# EAGLE design StandPanel (EAGLE 9.1.3)
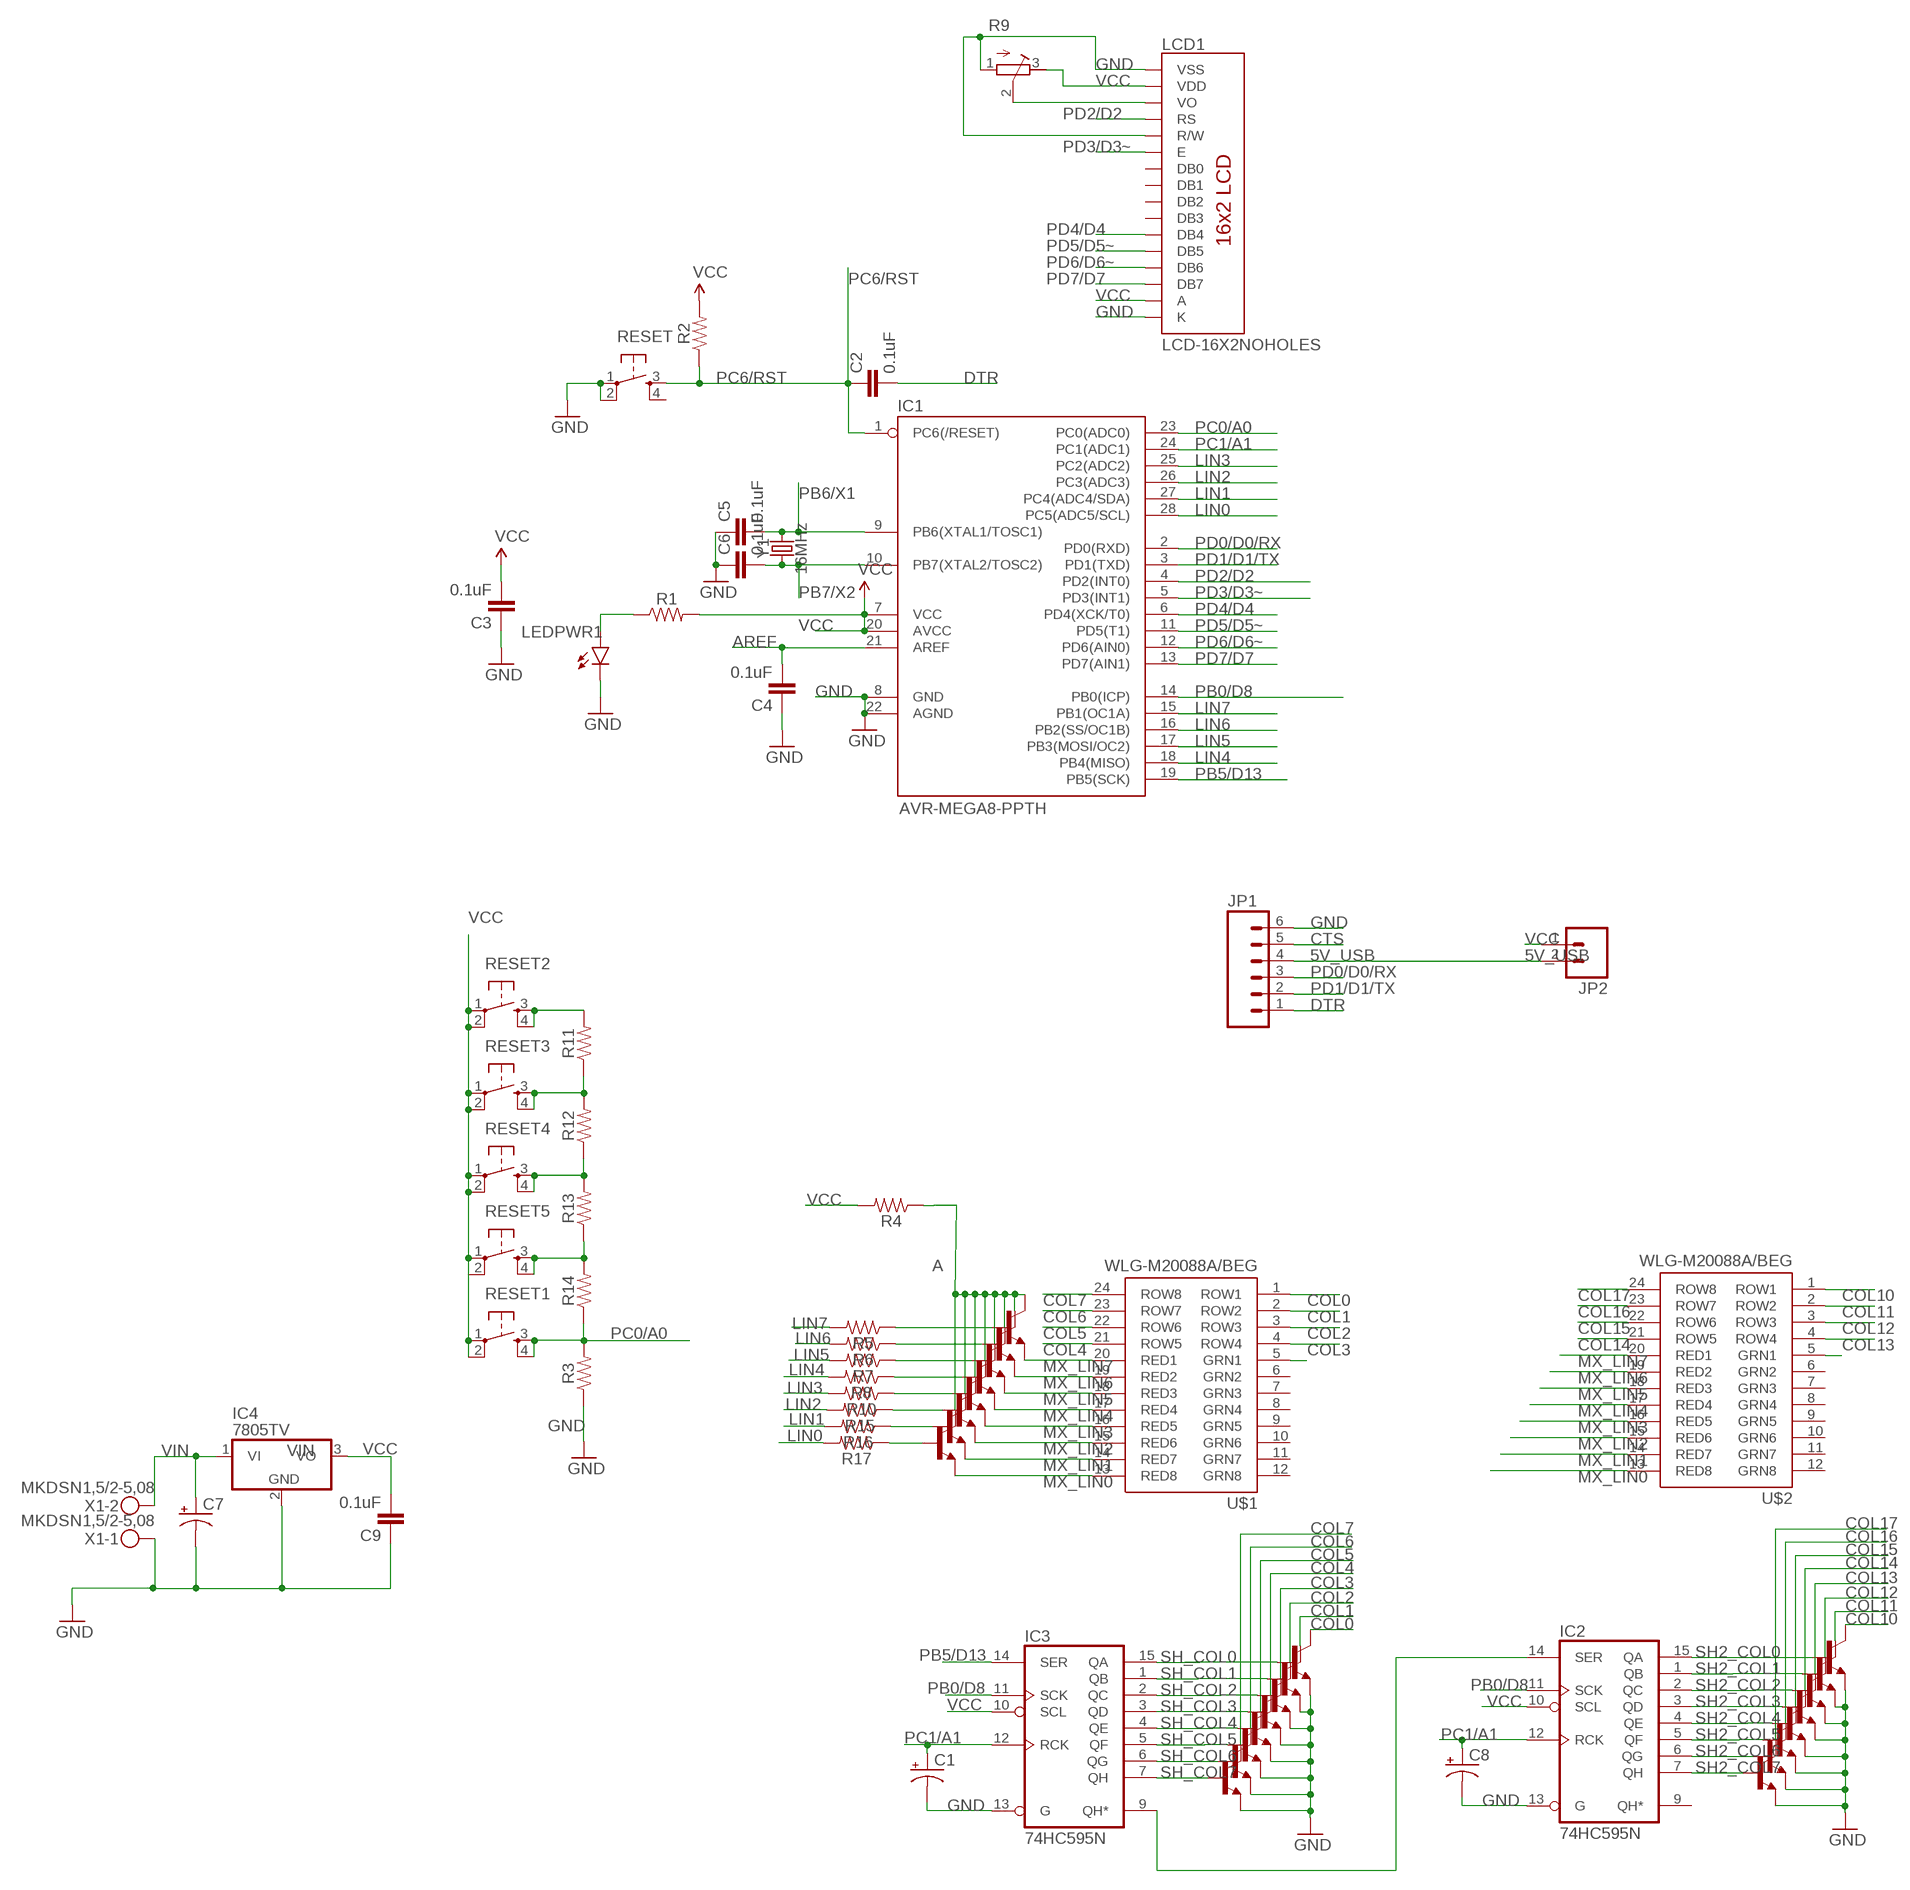
[diagram p0: schematic, sheet 1]

## Parts
C1  CAP_POLPTH2  [CPOL-RADIAL-10UF-25V]
C2  0.1uF  0.1UF-KIT-EZ-50V-20%  [CAP-PTH-SMALL-KIT]
C3  0.1uF  0.1UF-KIT-EZ-50V-20%  [CAP-PTH-SMALL-KIT]
C4  0.1uF  0.1UF-KIT-EZ-50V-20%  [CAP-PTH-SMALL-KIT]
C5  0.1uF  0.1UF-KIT-EZ-50V-20%  [CAP-PTH-SMALL-KIT]
C6  0.1uF  0.1UF-KIT-EZ-50V-20%  [CAP-PTH-SMALL-KIT]
C7  CAP_POLPTH1  [CPOL-RADIAL-100UF-25V]
C8  CAP_POLPTH2  [CPOL-RADIAL-10UF-25V]
C9  0.1uF  0.1UF-KIT-EZ-50V-20%  [CAP-PTH-SMALL-KIT]
IC1  AVR-MEGA8-PPTH  [DIL28-3]
IC2  74HC595N  [DIL16]
IC3  74HC595N  [DIL16]
IC4  7805TV  [TO220V]
JP1  M06SIP  [1X06]
JP2  M02PTH  [1X02]
LCD1  LCD-16X2NOHOLES  [LCD-16X2_NOHOLESNOSILK]
LEDPWR1  LED5MM-KIT  [LED_5MM-KIT]
R1  RESISTORAXIAL-0.3-KIT  [AXIAL-0.3-KIT]
R2  RESISTORAXIAL-0.3-KIT  [AXIAL-0.3-KIT]
R3  RESISTORAXIAL-0.3-KIT  [AXIAL-0.3-KIT]
R4  RESISTORAXIAL-0.3-KIT  [AXIAL-0.3-KIT]
R5  RESISTORAXIAL-0.3-KIT  [AXIAL-0.3-KIT]
R6  RESISTORAXIAL-0.3-KIT  [AXIAL-0.3-KIT]
R7  RESISTORAXIAL-0.3-KIT  [AXIAL-0.3-KIT]
R8  RESISTORAXIAL-0.3-KIT  [AXIAL-0.3-KIT]
R9  R-TRIMM3296W  [RTRIM3296W]
R10  RESISTORAXIAL-0.3-KIT  [AXIAL-0.3-KIT]
R11  RESISTORAXIAL-0.3-KIT  [AXIAL-0.3-KIT]
R12  RESISTORAXIAL-0.3-KIT  [AXIAL-0.3-KIT]
R13  RESISTORAXIAL-0.3-KIT  [AXIAL-0.3-KIT]
R14  RESISTORAXIAL-0.3-KIT  [AXIAL-0.3-KIT]
R15  RESISTORAXIAL-0.3-KIT  [AXIAL-0.3-KIT]
R16  RESISTORAXIAL-0.3-KIT  [AXIAL-0.3-KIT]
R17  RESISTORAXIAL-0.3-KIT  [AXIAL-0.3-KIT]
RESET  TAC_SWITCHPTH  [TACTILE-PTH]
RESET1  TAC_SWITCHPTH  [TACTILE-PTH]
RESET2  TAC_SWITCHPTH  [TACTILE-PTH]
RESET3  TAC_SWITCHPTH  [TACTILE-PTH]
RESET4  TAC_SWITCHPTH  [TACTILE-PTH]
RESET5  TAC_SWITCHPTH  [TACTILE-PTH]
T1  BC337  [TO92]
T3  BC337  [TO92]
T4  BC337  [TO92]
T5  BC337  [TO92]
T6  BC337  [TO92]
T7  BC337  [TO92]
T8  BC337  [TO92]
T9  BC337  [TO92]
T10  BC337  [TO92]
T11  BC337  [TO92]
T12  BC337  [TO92]
T13  BC337  [TO92]
T14  BC337  [TO92]
T15  BC337  [TO92]
T16  BC337  [TO92]
T17  BC337  [TO92]
T25  BC337  [TO92]
T26  BC337  [TO92]
T27  BC337  [TO92]
T28  BC337  [TO92]
T29  BC337  [TO92]
T30  BC337  [TO92]
T31  BC337  [TO92]
T32  BC337  [TO92]
U$1  WLG-M20088A/BEG  [WLG-M2088A/8EG]
U$2  WLG-M20088A/BEG  [WLG-M2088A/8EG]
X1  MKDSN1,5/2-5,08  [MKDSN1,5/2-5,08]
Y1  16MHz  CRYSTAL-16MHZPTH-HC49US  [HC49US]

## Nets
5V_USB: JP1.4 JP2.2
A: R4.P$1 T1.3(C) T3.3(C) T4.3(C) T5.3(C) T6.3(C) T7.3(C) T8.3(C) T9.3(C)
AREF: C4.2 IC1.21(AREF)
COL0: T10.3(C) U$1.1(ROW1)
COL1: T11.3(C) U$1.2(ROW2)
COL2: T12.3(C) U$1.3(ROW3)
COL3: T13.3(C) U$1.4(ROW4)
COL4: T14.3(C) U$1.21(ROW5)
COL5: T15.3(C) U$1.22(ROW6)
COL6: T16.3(C) U$1.23(ROW7)
COL7: T17.3(C) U$1.24(ROW8)
COL10: T25.3(C) U$2.1(ROW1)
COL11: T26.3(C) U$2.2(ROW2)
COL12: T27.3(C) U$2.3(ROW3)
COL13: T28.3(C) U$2.4(ROW4)
COL14: T29.3(C) U$2.21(ROW5)
COL15: T30.3(C) U$2.22(ROW6)
COL16: T31.3(C) U$2.23(ROW7)
COL17: T32.3(C) U$2.24(ROW8)
CTS: JP1.5
DTR: C2.2 JP1.1
GND: C1.2(-) C3.1 C4.1 C5.1 C6.1 C7.2(-) C8.2(-) C9.1 IC1.8(GND) IC1.22(AGND) IC2.13(G) IC3.13(G) IC4.2(GND) JP1.6 LCD1.1(VSS) LCD1.5(R/W) LCD1.16(K) LEDPWR1.K(C) R3.P$1 R9.1(A) RESET.1 RESET.2 T10.1(E) T11.1(E) T12.1(E) T13.1(E) T14.1(E) T15.1(E) T16.1(E) T17.1(E) T25.1(E) T26.1(E) T27.1(E) T28.1(E) T29.1(E) T30.1(E) T31.1(E) T32.1(E) X1.1
LIN0: IC1.28(PC5(ADC5/SCL)) R17.P$2
LIN1: IC1.27(PC4(ADC4/SDA)) R16.P$2
LIN2: IC1.26(PC3(ADC3)) R15.P$2
LIN3: IC1.25(PC2(ADC2)) R10.P$2
LIN4: IC1.18(PB4(MISO)) R8.P$2
LIN5: IC1.17(PB3(MOSI/OC2)) R7.P$2
LIN6: IC1.16(PB2(SS/OC1B)) R6.P$2
LIN7: IC1.15(PB1(OC1A)) R5.P$2
LIN8: T10.2(B)
MX_LIN0: T9.1(E) U$1.13(RED8) U$2.13(RED8)
MX_LIN1: T8.1(E) U$1.14(RED7) U$2.14(RED7)
MX_LIN2: T7.1(E) U$1.15(RED6) U$2.15(RED6)
MX_LIN3: T6.1(E) U$1.16(RED5) U$2.16(RED5)
MX_LIN4: T5.1(E) U$1.17(RED4) U$2.17(RED4)
MX_LIN5: T4.1(E) U$1.18(RED3) U$2.18(RED3)
MX_LIN6: T3.1(E) U$1.19(RED2) U$2.19(RED2)
MX_LIN7: T1.1(E) U$1.20(RED1) U$2.20(RED1)
N$1: LEDPWR1.A R1.P$1
N$2: R17.P$1 T9.2(B)
N$3: R16.P$1 T8.2(B)
N$4: U$1.5(GRN1)
N$5: LCD1.3(VO) R9.2(S)
N$6: R15.P$1 T7.2(B)
N$7: IC2.14(SER) IC3.9(QH*)
N$8: R10.P$1 T6.2(B)
N$9: R8.P$1 T5.2(B)
N$10: R7.P$1 T4.2(B)
N$11: R6.P$1 T3.2(B)
N$12: R5.P$1 T1.2(B)
N$18: U$2.5(GRN1)
N$30: R11.P$2 RESET2.3 RESET2.4
N$31: R11.P$1 R12.P$2 RESET3.3 RESET3.4
N$32: R12.P$1 R13.P$2 RESET4.3 RESET4.4
PB0/D8: IC1.14(PB0(ICP)) IC2.11(SCK) IC3.11(SCK)
PB5/D13: IC1.19(PB5(SCK)) IC3.14(SER)
PB6/X1: C5.2 IC1.9(PB6(XTAL1/TOSC1)) Y1.2
PB7/X2: C6.2 IC1.10(PB7(XTAL2/TOSC2)) Y1.1
PC0/A0: IC1.23(PC0(ADC0)) R3.P$2 R13.P$1 R14.P$1 R14.P$2 RESET1.3 RESET1.4 RESET5.3 RESET5.4
PC1/A1: C1.1(+) C8.1(+) IC1.24(PC1(ADC1)) IC2.12(RCK) IC3.12(RCK)
PC6/RST: C2.1 IC1.1(PC6(/RESET)) R2.P$1 RESET.3
PD0/D0/RX: IC1.2(PD0(RXD)) JP1.3
PD1/D1/TX: IC1.3(PD1(TXD)) JP1.2
PD2/D2: IC1.4(PD2(INT0)) LCD1.4(RS)
PD3/D3~: IC1.5(PD3(INT1)) LCD1.6(E)
PD4/D4: IC1.6(PD4(XCK/T0)) LCD1.11(DB4)
PD5/D5~: IC1.11(PD5(T1)) LCD1.12(DB5)
PD6/D6~: IC1.12(PD6(AIN0)) LCD1.13(DB6)
PD7/D7: IC1.13(PD7(AIN1)) LCD1.14(DB7)
SH2_COL0: IC2.15(QA) T25.2(B)
SH2_COL1: IC2.1(QB) T26.2(B)
SH2_COL2: IC2.2(QC) T27.2(B)
SH2_COL3: IC2.3(QD) T28.2(B)
SH2_COL4: IC2.4(QE) T29.2(B)
SH2_COL5: IC2.5(QF) T30.2(B)
SH2_COL6: IC2.6(QG) T31.2(B)
SH2_COL7: IC2.7(QH) T32.2(B)
SH_COL0: IC3.15(QA)
SH_COL1: IC3.1(QB) T11.2(B)
SH_COL2: IC3.2(QC) T12.2(B)
SH_COL3: IC3.3(QD) T13.2(B)
SH_COL4: IC3.4(QE) T14.2(B)
SH_COL5: IC3.5(QF) T15.2(B)
SH_COL6: IC3.6(QG) T16.2(B)
SH_COL7: IC3.7(QH) T17.2(B)
VCC: C3.2 C9.2 IC1.7(VCC) IC1.20(AVCC) IC2.10(SCL) IC3.10(SCL) IC4.3(VO) JP2.1 LCD1.2(VDD) LCD1.15(A) R1.P$2 R2.P$2 R4.P$2 R9.3(E) RESET2.1 RESET2.2 RESET3.1 RESET3.2 RESET4.1 RESET4.2 RESET5.1 RESET5.2
VCC1: RESET1.1 RESET1.2
VIN: C7.1(+) IC4.1(VI) X1.2
Unconnected: IC2.9(QH*) LCD1.7(DB0) LCD1.8(DB1) LCD1.9(DB2) LCD1.10(DB3) RESET.4 U$1.6(GRN2) U$1.7(GRN3) U$1.8(GRN4) U$1.9(GRN5) U$1.10(GRN6) U$1.11(GRN7) U$1.12(GRN8) U$2.6(GRN2) U$2.7(GRN3) U$2.8(GRN4) U$2.9(GRN5) U$2.10(GRN6) U$2.11(GRN7) U$2.12(GRN8)

## Power pins joined to a net without a drawn wire
GND: IC2.8(GND) IC3.8(GND)
VCC: IC2.16(VCC) IC3.16(VCC)

## Library data of the parts
C1 C7 C8 = SparkFun-Capacitors:CAP_POL: Capacitor Polarized These are standard SMD and PTH capacitors. Normally 10uF, 47uF, and 100uF in electrolytic and tantalum varieties. Always verify the external diameter of the through hole cap, it varies with capacity, voltage, and manufacturer. The EIA devices should be standard.
C2-C6 C9 = SparkFun-Capacitors:0.1UF: 0.1µF ceramic capacitors A capacitor is a passive two-terminal electrical component used to store electrical energy temporarily in an electric field.; PROD_ID: CAP-08370
IC1 = SparkFun-DigitalIC:AVR-MEGA8-P: MICROCONTROLLER 8 Kbytes FLASH 1 kbytes SRAM 512 bytes EEPROM USART 4-channel 10 bit ADC 2-channel 8 bit ADC
IC2 IC3 = 74xx-eu:74*595: 8-bit SHIFT REGISTER, output latch
IC4 = linear:78*: Positive VOLTAGE REGULATOR Source: http://cache.national.com/ds/LM/LM78L05.pdf http://www.fairchildsemi.com/ds/LM/LM7805.pdf
JP1 = SparkFun:M06: Header 6 Standard 6-pin 0.1" header. Use with straight break away headers (SKU : PRT-00116), right angle break away headers (PRT-00553), swiss pins (PRT-00743), machine pins (PRT-00117), and female headers (PRT-00115). Molex polarized connector foot print use with SKU : PRT-08094 with associated crimp pins and housings. NOTES ON THE VARIANTS LOCK and LOCK_LONGPADS... This footprint was designed to help hold the alignment of a through-hole component (i.e. 6-pin header) while soldering it into place. You may notice that each hole has been shifted either up or down by 0.005 of an inch from it's more standard position (which is a perfectly straight line). This slight alteration caused the pins (the squares in the middle) to touch the edges of the holes. Because they are alternating, it causes a "brace" to hold the component in place. 0.005 has proven to be the perfect amount of "off-center" position when using our standard breakaway headers. Although looks a little odd when you look at the bare footprint, once you have a header in there, the alteration is very hard to notice. Also, if you push a header all the way into place, it is covered up entirely on the bottom side. This idea of altering the position of holes to aid alignment will be further integrated into the Sparkfun Library for other footprints. It can help hold any component with 3 or more connection pins.
JP2 = SparkFun:M02: Header 2 Standard 2-pin 0.1" header. Use with straight break away headers (SKU : PRT-00116), right angle break away headers (PRT-00553), swiss pins (PRT-00743), machine pins (PRT-00117), and female headers (PRT-00115). Molex polarized connector foot print use with SKU : PRT-08233 with associated crimp pins and housings.
LCD1 = SparkFun-Displays:LCD-16X2: Standard text-only 16x2 parallel input LCD Basic 16 character by 2 line display. Typically utilizes the extremely common HD44780 parallel interface chipset SparkFun Products: Basic 16x2 Green <https://www.sparkfun.com/products/255> Basic 8x2 Green <https://www.sparkfun.com/products/11122>; SF_ID: LCD-00255
LEDPWR1 = SparkFun-LED:LED: LED (Generic) Standard schematic elements and footprints for 5mm, 3mm, 1206, and 0603 sized LEDs. Generic LEDs with no color specified.
R1-R8 R10-R17 = SparkFun-Resistors:RESISTOR: Generic Resistor Package
R9 = resistor:R-TRIMM: Trimm resistor
RESET RESET1-RESET5 = SparkFun-Electromechanical:TAC_SWITCH: Momentary Switch Button commonly used for reset or general input. Spark Fun Electronics SKU : COM-00097
T1 T3-T17 T25-T32 = transistor:BC337: NPN TRANSISTOR
U$1 U$2 = led-matrix-v3:WLG-M20088A/BEG: LED Matrix - Dual Color (Red + Green) - Medium sku: COM-00682 0.33 x 2 x 2"
X1 = con-phoenix-508:MKDSN1,5/2-5,08: MKDSN 1,5/ 2-5,08 Printklemme Nennstrom: 13,5 A Nennspannung: 250 V Rastermaß: 5,08 mm Polzahl: 2 Anschlussart: Schraubanschluss Montage: Löten Anschlussrichtung Leiter/Platine: 0 ° Artikelnummer: 1729128 Source: http://eshop.phoenixcontact.com .. 1729128.pdf
Y1 = SparkFun-Clocks:CRYSTAL-16MHZ: 16MHz Crystal Digikey Example <http://www.digikey.com/product-search/en?keywords=535-9122-1-ND> Frequency: 16MHz Frequency Stability: ±50ppm Frequency Tolerance: ±20ppm Load Capacitance: 18pF SparkFun Products: Pro Micro -5V/16MHz <https://www.sparkfun.com/products/12640> SparkFun Serial Enabled LCD Kit <https://www.sparkfun.com/products/10097>; PROD_ID: XTAL-08181; SF_ID: COM-00536

## Net classes
0 default: width 0.8 mm, drill 0.9 mm, clearance 0.406 mm

## Board
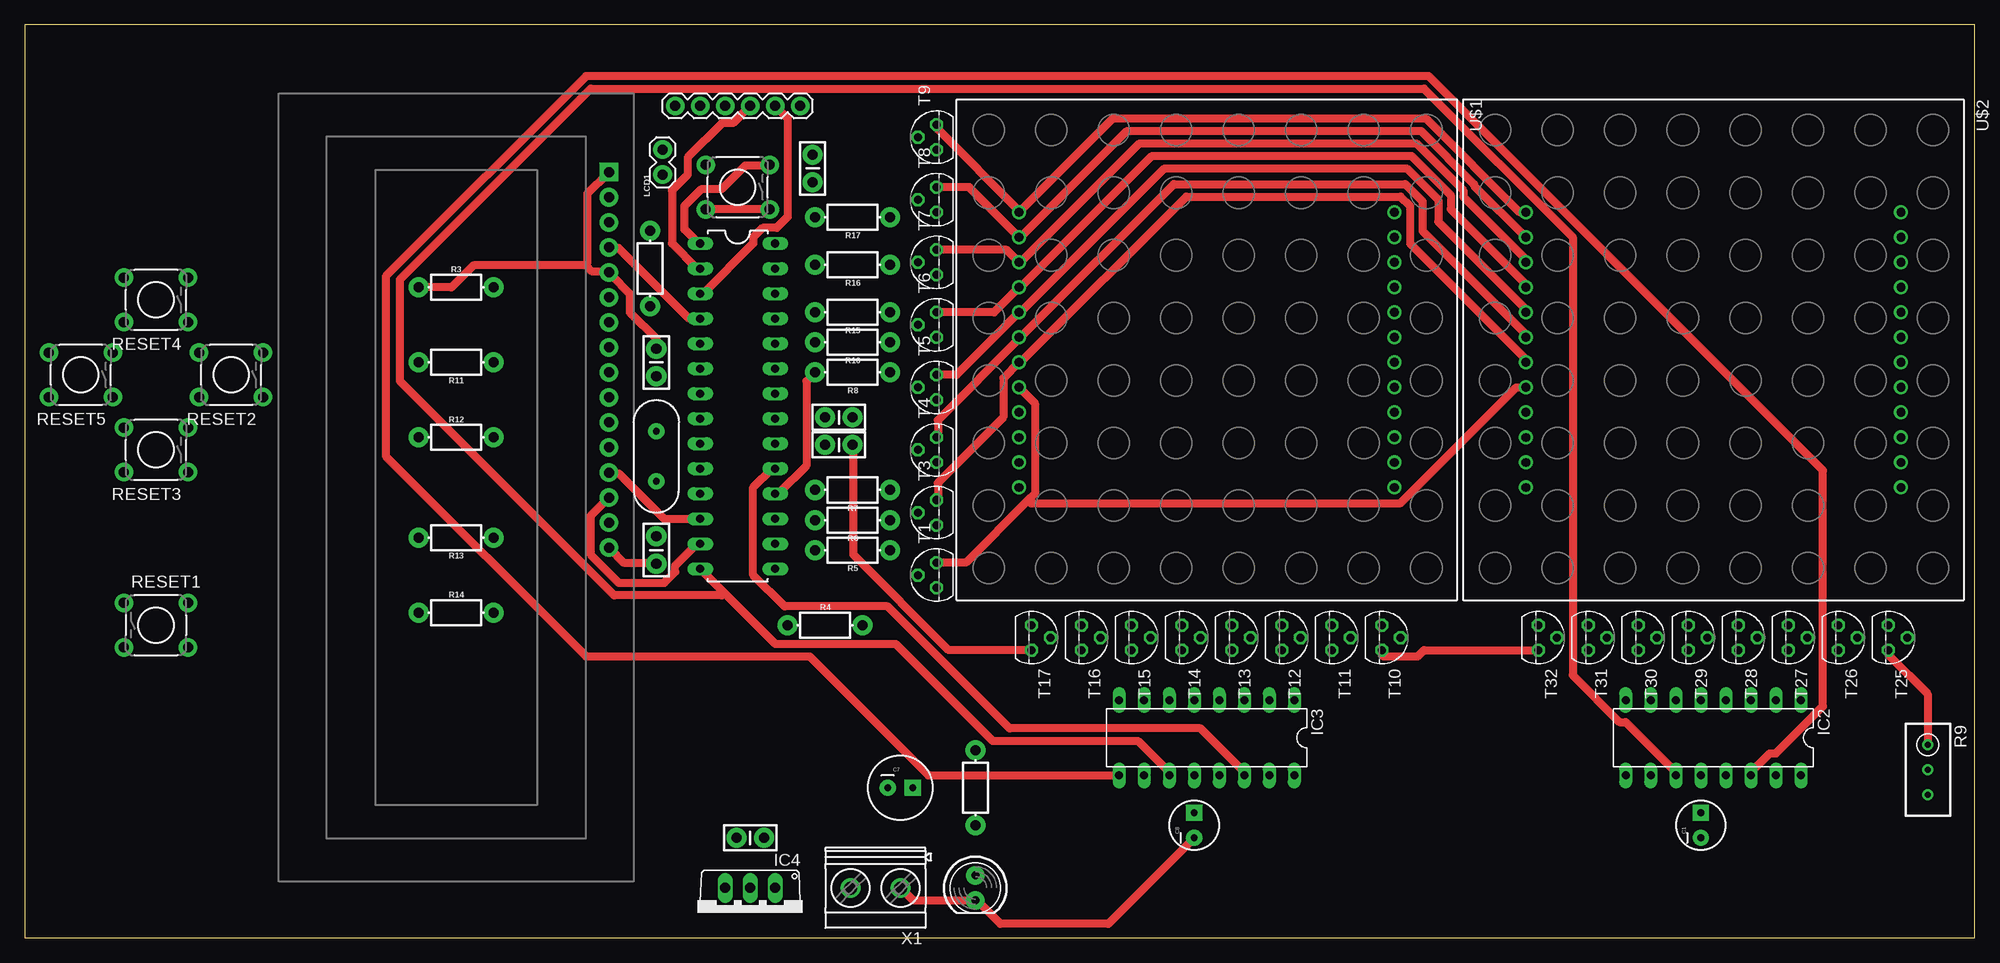
[diagram p1: board, top side]
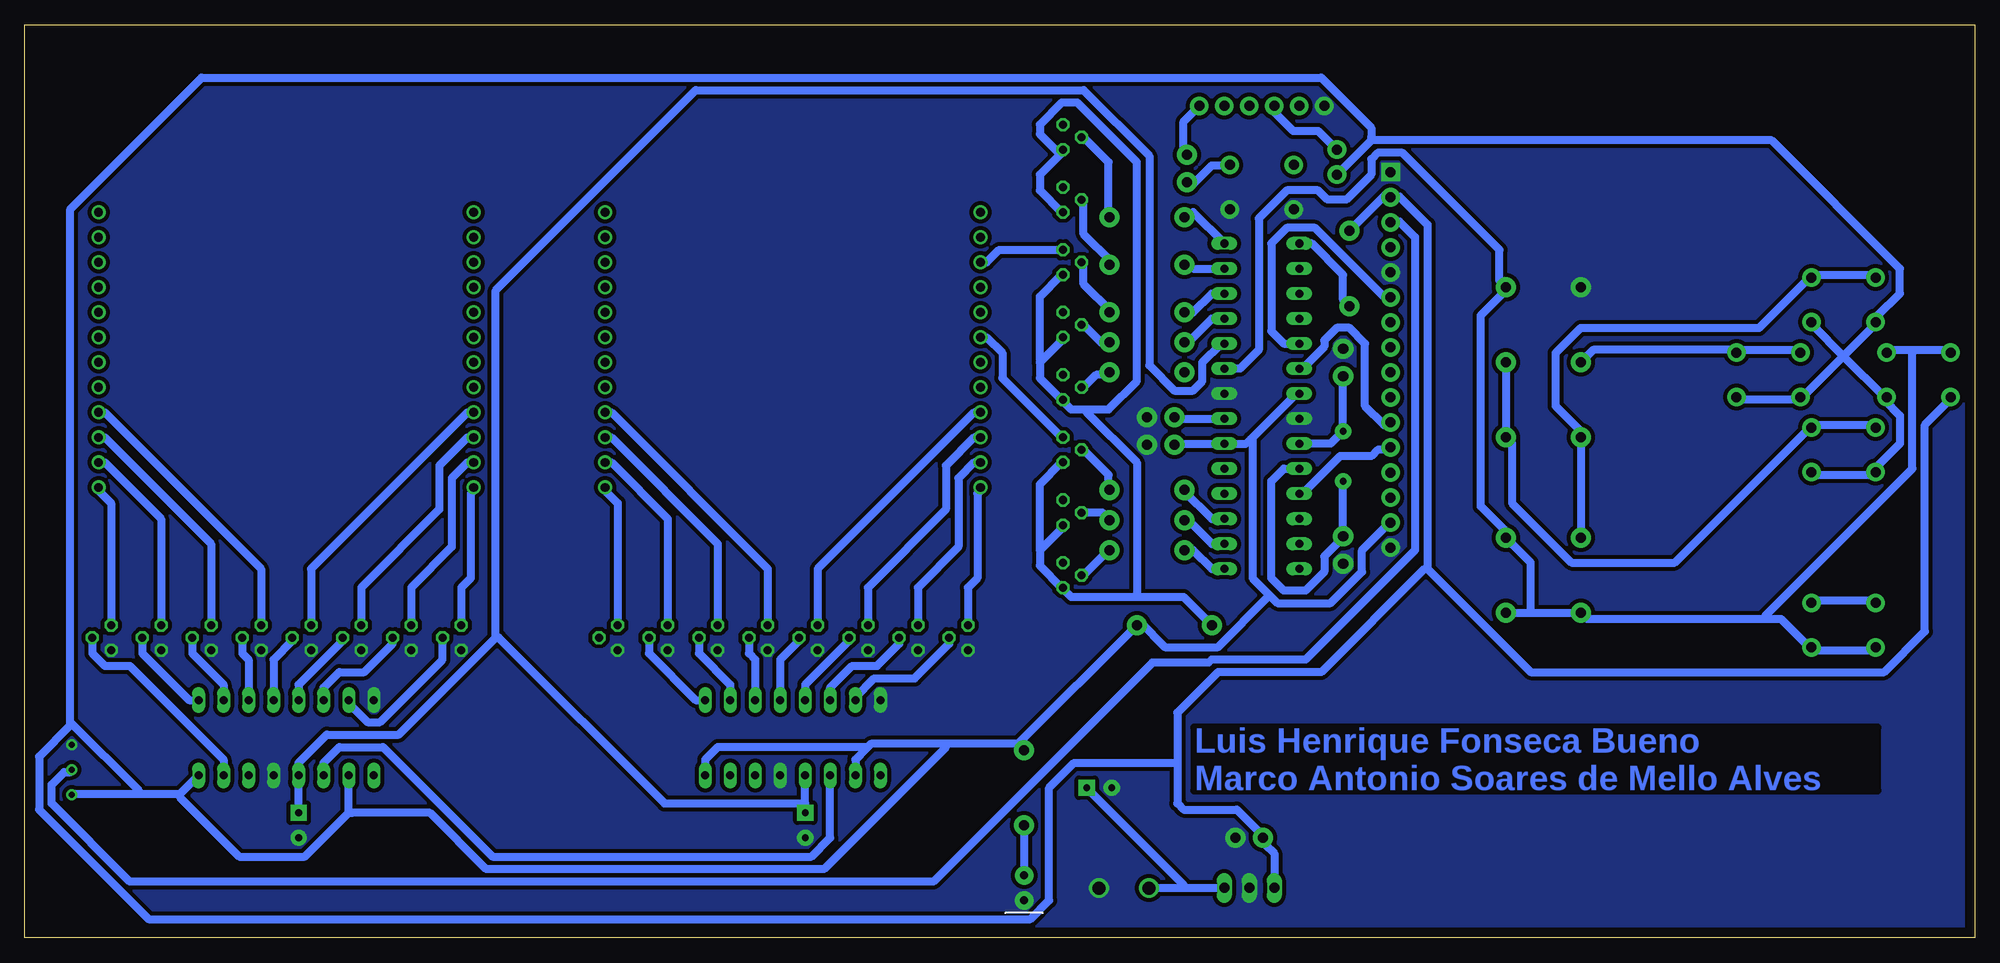
[diagram p2: board, bottom side, seen from below]

Size 198 x 92.7 mm. Coordinates in mm from the lower left corner, seen from the top.
Outline: 0,0 198,0 198,92.7 0,92.7 0,0
Copper layers (1*16): Top 0.035mm / dielectric 1.5mm / Bottom 0.035mm
Design rules "default": minimum track width 10mil, minimum drill 24mil, track to track 8mil, track to pad 8mil, pad to pad 8mil, via to via 8mil, smd to smd 8mil, copper to edge 40mil, drill to drill 8mil, minimum pad ring 10mil, minimum via ring 8mil, stop-mask expansion 4mil, vias tented up to drill 0mil, thermal gap 10mil

### Footprints (pad centres in the part's own frame; a part is rotated, then mirrored left to right if it is on the bottom)
CPOL-RADIAL-10UF-25V = drill 0.7 pad 1.651 square: 1 1.27,0 | drill 0.7 pad 1.651: 2 -1.27,0
CAP-PTH-SMALL-KIT = drill 1.016 pad 2.032: 1 -1.397,0; 2 1.397,0
CPOL-RADIAL-100UF-25V = drill 0.7 pad 1.651 square: 1 1.27,0 | drill 0.7 pad 1.651: 2 -1.27,0
DIL28-3 = drill 0.813 long: 1 -16.51,-3.81; 2 -13.97,-3.81; 3 -11.43,-3.81; 4 -8.89,-3.81; 5 -6.35,-3.81; 6 -3.81,-3.81; 7 -1.27,-3.81; 8 1.27,-3.81; 9 3.81,-3.81; 10 6.35,-3.81; 11 8.89,-3.81; 12 11.43,-3.81; 13 13.97,-3.81; 14 16.51,-3.81; 15 16.51,3.81; 16 13.97,3.81; 17 11.43,3.81; 18 8.89,3.81; 19 6.35,3.81; 20 3.81,3.81; 21 1.27,3.81; 22 -1.27,3.81; 23 -3.81,3.81; 24 -6.35,3.81; 25 -8.89,3.81; 26 -11.43,3.81; 27 -13.97,3.81; 28 -16.51,3.81
DIL16 = drill 0.813 long: 1 -8.89,-3.81; 2 -6.35,-3.81; 3 -3.81,-3.81; 4 -1.27,-3.81; 5 1.27,-3.81; 6 3.81,-3.81; 7 6.35,-3.81; 8 8.89,-3.81; 9 8.89,3.81; 10 6.35,3.81; 11 3.81,3.81; 12 1.27,3.81; 13 -1.27,3.81; 14 -3.81,3.81; 15 -6.35,3.81; 16 -8.89,3.81
TO220V = drill 1.016 long: 1 -2.54,-2.54; 2 0,-2.54; 3 2.54,-2.54
1X06 = drill 1.016 pad 1.88: 1 0,0; 2 2.54,0; 3 5.08,0; 4 7.62,0; 5 10.16,0; 6 12.7,0
1X02 = drill 1.016 pad 1.88: 1 0,0; 2 2.54,0
LCD-16X2_NOHOLESNOSILK = drill 1.016 pad 1.88 square: 1 -32,15.5 | drill 1.016 pad 1.88: 2 -29.46,15.5; 3 -26.92,15.5; 4 -24.38,15.5; 5 -21.84,15.5; 6 -19.3,15.5; 7 -16.76,15.5; 8 -14.22,15.5; 9 -11.68,15.5; 10 -9.14,15.5; 11 -6.6,15.5; 12 -4.06,15.5; 13 -1.52,15.5; 14 1.02,15.5; 15 3.56,15.5; 16 6.1,15.5
LED_5MM-KIT = drill 0.813 pad 1.88: A -1.27,0; K 1.27,0
AXIAL-0.3-KIT = drill 1.016 pad 2.032: P$1 -3.81,0; P$2 3.81,0
RTRIM3296W = drill 0.61: 1 0,-2.54; 2 0,0; 3 0,2.54
TACTILE-PTH = drill 1.016 pad 1.88: 1 -3.251,2.261; 2 3.251,2.261; 3 -3.251,-2.261; 4 3.251,-2.261
TO92 = drill 0.813 octagon: 1 1.27,0; 2 0,1.905; 3 -1.27,0
WLG-M2088A/8EG = drill 0.9 pad 1.422: 1 13.97,19.05; 2 11.43,19.05; 3 8.89,19.05; 4 6.35,19.05; 5 3.81,19.05; 6 1.27,19.05; 7 -1.27,19.05; 8 -3.81,19.05; 9 -6.35,19.05; 10 -8.89,19.05; 11 -11.43,19.05; 12 -13.97,19.05; 13 -13.97,-19.05; 14 -11.43,-19.05; 15 -8.89,-19.05; 16 -6.35,-19.05; 17 -3.81,-19.05; 18 -1.27,-19.05; 19 1.27,-19.05; 20 3.81,-19.05; 21 6.35,-19.05; 22 8.89,-19.05; 23 11.43,-19.05; 24 13.97,-19.05
MKDSN1,5/2-5,08 = drill 1.3 pad 2: 1 -2.561,0.025; 2 2.519,0.025
HC49US = drill 0.7 pad 1.651: 1 -2.54,0; 2 2.54,0

### Placement (x,y rotation side)
C1  170.18,11.43 90 top
C2  80.01,78.11 90 top
C3  82.68,50.04 180 top
C4  82.68,52.83 180 top
C5  64.14,58.42 270 top
C6  64.14,39.37 90 top
C7  88.9,15.24 0 top
C8  118.75,11.43 90 top
C9  73.66,10.16 180 top
IC1  72.39,53.98 270 top
IC2  171.45,20.32 180 top
IC3  120.02,20.32 180 top
IC4  73.66,2.54 180 top
JP1  78.74,84.45 180 top
JP2  64.77,77.47 90 top
LCD1  43.81,45.72 270 top
LEDPWR1  96.52,5.08 270 top
R1  96.52,15.24 90 top
R2  63.5,67.94 90 top
R3  43.81,66.04 0 top
R4  81.28,31.75 0 top
R5  84.07,39.37 180 top
R6  84.07,42.42 180 top
R7  84.07,45.47 180 top
R8  84.07,57.4 180 top
R9  193.23,17.07 180 top
R10  84.07,60.45 180 top
R11  43.81,58.42 180 top
R12  43.81,50.8 0 top
R13  43.81,40.64 180 top
R14  43.81,33.02 0 top
R15  84.07,63.5 180 top
R16  84.07,68.33 180 top
R17  84.07,73.15 180 top
RESET  72.39,76.2 180 top
RESET1  13.34,31.75 0 top
RESET2  20.95,57.15 180 top
RESET3  13.34,49.53 180 top
RESET4  13.34,64.77 180 top
RESET5  5.71,57.15 180 top
T1  92.58,36.83 90 top
T3  92.58,43.18 90 top
T4  92.58,49.53 90 top
T5  92.58,55.88 90 top
T6  92.58,62.23 90 top
T7  92.58,68.58 90 top
T8  92.58,74.93 90 top
T9  92.58,81.28 90 top
T10  137.79,30.48 270 top
T11  132.72,30.48 270 top
T12  127.64,30.48 270 top
T13  122.56,30.48 270 top
T14  117.47,30.48 270 top
T15  112.39,30.48 270 top
T16  107.31,30.48 270 top
T17  102.23,30.48 270 top
T25  189.23,30.48 270 top
T26  184.15,30.48 270 top
T27  179.07,30.48 270 top
T28  173.99,30.48 270 top
T29  168.91,30.48 270 top
T30  163.83,30.48 270 top
T31  158.75,30.48 270 top
T32  153.67,30.48 270 top
U$1  120.02,59.69 270 top
U$2  171.45,59.69 270 top
X1  86.36,5.08 180 top
Y1  64.14,48.9 90 top

### Tracks (layer width: path | path; a pad name or v marks a point on that pad's centre or on a via)
5V_USB
  Bottom 0.8: JP2.2 66.67,81.92 69.22,81.92 71.12,83.82 JP1.4
A
  Bottom 0.8: 94.93,39.37 94.93,37.78 92.71,35.56 T1.3 92.39,35.24 91.76,34.61 85.09,34.61 | 94.93,39.37 92.39,41.91 T3.3 | T4.3 92.71,48.26 94.93,46.04 94.93,39.69 94.93,39.37 | R4.P$1 80.33,34.61 85.09,34.61 | T8.3 92.71,73.66 94.93,75.88 94.93,77.47 92.39,80.01 T9.3 93.03,79.69 94.93,81.6 94.93,82.55 92.71,84.77 91.12,84.77 85.09,78.74 85.09,56.52 87.95,53.66 90.17,53.66 | 94.93,58.42 94.93,56.83 92.71,54.61 T5.3 92.39,54.29 91.76,53.66 90.17,53.66 | 94.93,58.42 92.39,60.96 T6.3 | T7.3 92.71,67.31 94.93,65.09 94.93,58.74 94.93,58.42 | 85.09,34.61 85.09,34.92 85.09,48.26 90.17,53.34 90.17,53.66
AREF
  Bottom 0.8: IC1.21 81.28,52.7 C4.2
COL0
  Bottom 0.8: T10.3 137.79,44.13 139.06,45.4 U$1.1
COL1
  Bottom 0.8: T11.3 132.72,42.55 138.43,48.26 U$1.2
COL2
  Bottom 0.8: T12.3 127.64,40.01 138.43,50.8 U$1.3
COL3
  Bottom 0.8: T13.3 122.56,37.47 138.43,53.34 U$1.4
COL4
  Bottom 0.8: T14.3 117.47,37.47 101.6,53.34 U$1.21
COL5
  Bottom 0.8: T15.3 112.39,35.56 104.46,43.5 104.46,47.94 101.6,50.8 U$1.22
COL6
  Bottom 0.8: T16.3 107.31,35.56 103.19,39.69 103.19,46.67 101.6,48.26 U$1.23
COL7
  Bottom 0.8: T17.3 102.23,35.56 101.28,36.51 101.28,45.09 100.97,45.4 U$1.24
COL10
  Bottom 0.8: T25.3 189.23,44.13 190.5,45.4 U$2.1
COL11
  Bottom 0.8: T26.3 184.15,42.55 189.87,48.26 U$2.2
COL12
  Bottom 0.8: T27.3 179.07,40.01 189.87,50.8 U$2.3
COL13
  Bottom 0.8: T28.3 173.99,37.47 189.87,53.34 U$2.4
COL14
  Bottom 0.8: T29.3 168.91,37.47 153.03,53.34 U$2.21
COL15
  Bottom 0.8: T30.3 163.83,35.56 155.89,43.5 155.89,47.94 153.03,50.8 U$2.22
COL16
  Bottom 0.8: T31.3 158.75,35.56 154.62,39.69 154.62,46.67 153.03,48.26 U$2.23
COL17
  Bottom 0.8: T32.3 153.67,35.56 152.72,36.51 152.72,45.09 152.4,45.4 U$2.24
DTR
  Bottom 0.8: JP1.1 80.33,82.87 80.33,80.01 80.01,79.69 C2.2
GND
  Top 0.8: RESET.2 69.22,73.98 75.56,73.98 RESET.1 | C6.1 64.14,38.1 60.8,38.1 59.37,39.53 LCD1.16 | R3.P$1 43.34,66.04 45.56,68.26 56.99,68.26 | 56.99,68.26 57.63,67.63 59.21,67.63 LCD1.5 59.53,67.31 61.44,65.41 61.44,63.5 64.14,60.8 64.14,59.85 C5.1 | LCD1.1 59.21,77.63 57.15,75.56 57.15,68.58 56.99,68.26 | T25.1 189.23,28.73 193.2,24.77 193.2,19.68 R9.1 | X1.1 89.06,4.92 90.17,3.81 LEDPWR1.K 96.84,3.65 99.06,1.43 110.01,1.43 C8.2 | T32.1 142.08,29.21 141.45,28.57 137.95,28.57 137.79,28.73 T10.1 | T17.1 93.82,29.21 84.14,38.89 84.14,50.01 C3.1
  pour Bottom (isolate 0.406, no thermals): 0,0 198,0 198,92.7 0,92.7
LIN0
  Bottom 0.8: IC1.28 79.38,73.66 80.01,73.03 R17.P$2
LIN1
  Bottom 0.8: IC1.27 79.38,67.94 80.01,68.58 R16.P$2
LIN2
  Bottom 0.8: IC1.26 77.47,65.41 79.38,63.5 80.01,63.5 R15.P$2
LIN3
  Bottom 0.8: IC1.25 77.47,62.87 80.01,60.33 R10.P$2
LIN4
  Top 0.8: IC1.18 76.52,45.09 79.38,47.94 79.38,56.52 80.17,57.31 R8.P$2
LIN5
  Bottom 0.8: IC1.17 77.47,42.55 80.33,45.4 R7.P$2
LIN6
  Bottom 0.8: IC1.16 77.47,40.01 80.01,42.55 R6.P$2
LIN7
  Bottom 0.8: IC1.15 77.47,37.47 79.38,39.37 80.01,39.37 R5.P$2
MX_LIN0
  Top 0.8: T9.1 92.71,82.55 92.71,82.07 100.97,73.82 U$1.13 101.28,73.98 110.49,83.19 142.24,83.19 151.76,73.66 U$2.13
MX_LIN1
  Top 0.8: T8.1 92.71,76.2 95.89,76.2 U$1.14 101.28,71.28 111.92,81.92 141.76,81.92 147.16,76.52 147.16,76.36 U$2.14
MX_LIN2
  Top 0.8: T7.1 92.71,69.85 99.69,69.85 U$1.15 101.28,68.74 113.19,80.64 141.29,80.64 146.05,75.88 146.05,75.25 152.4,68.9 U$2.15
  Bottom 0.8: U$1.15 100.33,68.58 99.06,69.85 92.71,69.85 T7.1
MX_LIN3
  Top 0.8: T6.1 92.71,63.5 98.42,63.5 U$1.16 101.28,66.2 114.46,79.38 140.81,79.38 144.78,75.41 144.78,73.98 152.4,66.36 U$2.16
MX_LIN4
  Top 0.8: T5.1 92.71,57.15 94.61,57.15 U$1.17 101.28,63.66 115.73,78.11 140.34,78.11 143.51,74.93 143.51,72.71 152.4,63.82 U$2.17
MX_LIN5
  Top 0.8: T4.1 92.71,50.8 92.71,52.55 100.97,60.8 U$1.18 101.28,61.12 116.68,76.52 140.18,76.52 141.92,74.77 141.92,71.75 152.4,61.28 U$2.18
  Bottom 0.8: U$1.18 100.33,60.96 98.74,59.37 98.74,56.83 92.71,50.8 T4.1
MX_LIN6
  Top 0.8: T3.1 92.71,44.45 92.71,46.2 99.38,52.86 99.38,56.83 U$1.19 101.28,58.58 117.95,75.25 139.7,75.25 140.65,74.3 140.65,70.48 152.4,58.74 U$2.19
MX_LIN7
  Top 0.8: 101.84,44.37 102.55,45.09 102.55,54.29 U$1.20 | 101.84,44.37 95.57,38.1 92.71,38.1 T1.1 | U$2.20 151.45,55.88 139.7,44.13 102.08,44.13 101.84,44.37
N$1
  Bottom 0.8: R1.P$1 LEDPWR1.A
N$2
  Bottom 0.8: T9.2 90.49,81.28 87.95,78.74 87.95,73.34 R17.P$1
N$3
  Bottom 0.8: T8.2 90.49,74.93 90.49,71.44 87.63,68.58 R16.P$1
N$5
  Bottom 0.8: R9.2 193.36,16.83 193.99,16.83 195.26,15.56 195.26,13.65 187.32,5.71 105.73,5.71 83.5,27.94 77.79,27.94 77.47,28.26 67.94,28.26 56.83,39.37 56.83,71.12 58.42,72.71 59.05,72.71 LCD1.3
N$6
  Bottom 0.8: T7.2 90.49,68.58 90.49,66.36 87.63,63.5 R15.P$1
N$7
  Top 0.8: IC3.9 91.76,16.51 79.69,28.57 56.99,28.57 36.67,48.9 36.67,67.15 56.99,87.47 142.56,87.47 182.56,47.47 182.56,23.5 177.8,18.73 177.16,18.73 175.26,16.83 IC2.14
N$8
  Bottom 0.8: T6.2 90.49,62.23 88.58,60.33 87.95,60.33 R10.P$1
N$9
  Bottom 0.8: T5.2 90.49,55.88 89.22,57.15 87.95,57.15 R8.P$1
N$10
  Bottom 0.8: T4.2 90.49,49.53 87.95,46.99 87.95,45.72 R7.P$1
N$11
  Bottom 0.8: T3.2 90.49,43.18 88.58,43.18 87.95,42.55 R6.P$1
N$12
  Bottom 0.8: T1.2 90.49,36.83 87.95,39.37 R5.P$1
N$30
  Bottom 0.8: RESET2.4 17.78,59.69 24.13,59.69 RESET2.3 24.45,59.69 38.73,59.69 R11.P$2
N$31
  Bottom 0.8: RESET3.4 10.16,52.07 16.51,52.07 RESET3.3 16.83,51.75 30.48,38.1 40.96,38.1 46.99,44.13 46.99,50.16 R12.P$2 R11.P$1
N$32
  Bottom 0.8: RESET4.4 10.16,67.31 16.51,67.31 RESET4.3 16.83,66.99 21.91,61.91 40.01,61.91 42.55,59.37 42.55,53.98 39.69,51.12 39.69,50.8 R12.P$1 R13.P$2
PB0/D8
  Top 0.8: IC3.11 116.2,16.83 113.03,20 98.27,20 88.42,29.84 76.2,29.84 71.04,35 | IC1.14 71.04,35 | IC2.11 167.64,16.83 162.56,21.91 161.93,21.91 157.16,26.67 157.16,71.12 142.08,86.2 57.47,86.2 38.1,66.83 38.1,56.52 59.85,34.77 70.8,34.77 71.04,35
  Bottom 0.8: IC3.11 116.2,10.16 118.11,8.26 150.5,8.26 161.61,19.37 166.05,19.37 167.64,17.78 IC2.11
PB5/D13
  Top 0.8: IC1.19 75.88,47.62 73.98,45.72 73.98,36.83 77.15,33.66 87.63,33.66 100.01,21.27 119.38,21.27 123.83,16.83 IC3.14
PB6/X1
  Bottom 0.8: IC1.9 65.41,50.16 Y1.2 64.14,51.75 64.14,56.83 C5.2
PB7/X2
  Bottom 0.8: IC1.10 70.17,47.62 71.44,46.35 71.44,36.51 70.17,35.24 67.94,35.24 66.04,37.15 66.04,38.73 64.14,40.64 C6.2 64.14,40.96 Y1.1
PC0/A0
  Bottom 0.8: IC1.23 74.61,57.78 72.71,59.69 72.71,73.03 69.85,75.88 66.67,75.88 65.72,74.93 63.82,74.93 61.28,77.47 61.28,79.06 60.64,79.69 58.1,79.69 48.26,69.85 48.26,66.67 R3.P$2 47.62,65.72 50.16,63.18 50.16,43.81 47.31,40.96 47.31,40.64 R13.P$1 45.09,38.1 45.09,33.34 45.09,33.02 | 6.35,59.69 8.89,59.69 RESET5.3 | 6.35,59.69 2.54,59.69 RESET5.4 | RESET1.3 10.16,29.21 16.51,29.21 RESET1.4 16.83,29.53 19.68,32.38 21.27,32.38 | R14.P$2 45.09,33.02 | 45.09,33.02 R14.P$1 39.37,32.38 21.27,32.38 | 6.35,59.69 6.35,59.37 6.35,47.62 21.27,32.7 21.27,32.38
PC1/A1
  Bottom 0.8: C8.1 118.75,13.65 | 118.75,13.65 IC3.12 | C1.1 IC2.12 170.18,16.83 170.18,17.78 167.32,20.64 160.02,20.64 150.18,30.48 | IC1.24 76.52,60.33 78.42,58.42 78.42,56.52 79.38,55.56 81.28,55.56 83.82,58.1 83.82,79.38 90.49,86.04 129.86,86.04 150.18,65.72 150.18,30.48 | 118.75,13.65 119.06,13.65 133.03,13.65 149.86,30.48 150.18,30.48
PC6/RST
  Top 0.8: IC1.1 68.42,70.48 66.99,71.91 66.99,74.3 68.74,76.04 70.8,76.04 73.18,78.42 75.56,78.42 RESET.3
  Bottom 0.8: RESET.3 75.88,78.42 77.47,78.42 79.38,76.52 80.01,76.52 C2.1 | IC1.1 67.31,70.48 64.14,67.31 64.14,64.77 R2.P$1
PD0/D0/RX
  Top 0.8: IC1.2 68.26,67.94 65.72,70.48 65.72,75.88 67.31,77.47 67.31,79.22 70.8,82.71 71.91,82.71 JP1.3
PD1/D1/TX
  Top 0.8: IC1.3 68.9,65.41 73.98,70.48 73.98,71.12 74.93,72.07 76.36,72.07 77.47,73.18 77.47,83.19 JP1.2
PD2/D2
  Top 0.8: IC1.4 67.47,62.87 60.33,70.01 59.37,70.01 LCD1.4
PD3/D3~
  Bottom 0.8: IC1.5 70.17,60.33 71.44,61.59 71.44,70.48 69.85,72.07 66.99,72.07 60.01,65.09 59.37,65.09 LCD1.6
PD4/D4
  Bottom 0.8: IC1.6 68.26,57.78 66.04,60.01 66.04,60.64 64.77,61.91 63.5,61.91 61.91,60.33 61.91,53.98 60.01,52.07 59.37,52.07 LCD1.11
PD5/D5~
  Bottom 0.8: IC1.11 68.26,45.09 64.45,48.9 61.28,48.9 60.64,49.53 59.37,49.53 LCD1.12
PD6/D6~
  Top 0.8: IC1.12 64.93,42.55 60.33,47.15 59.37,47.15 LCD1.13
PD7/D7
  Top 0.8: IC1.13 68.26,40.01 66.04,37.78 66.04,37.15 64.93,36.04 60.33,36.04 57.47,38.89 57.47,42.86 59.21,44.61 LCD1.14
SH2_COL0
  Bottom 0.8: IC2.15 177.8,18.1 187.32,27.62 189.87,27.62 191.13,28.89 T25.2
SH2_COL1
  Bottom 0.8: IC2.1 181.29,24.13 186.06,28.89 T26.2
SH2_COL2
  Bottom 0.8: IC2.2 177.8,25.72 180.97,28.89 T27.2
SH2_COL3
  Bottom 0.8: IC2.3 175.26,28.26 175.9,28.89 T28.2
SH2_COL4
  Bottom 0.8: IC2.4 172.72,28.26 170.81,30.16 T29.2
SH2_COL5
  Bottom 0.8: IC2.5 170.18,25.72 165.74,30.16 T30.2
SH2_COL6
  Bottom 0.8: T31.2 160.66,29.84 163.51,26.99 166.05,26.99 167.64,25.4 IC2.6
SH2_COL7
  Bottom 0.8: T32.2 155.57,28.26 161.93,21.91 163.19,21.91 165.1,23.81 IC2.7
SH_COL1
  Bottom 0.8: IC3.1 129.86,24.13 134.62,28.89 T11.2
SH_COL2
  Bottom 0.8: IC3.2 126.36,25.72 129.54,28.89 T12.2
SH_COL3
  Bottom 0.8: IC3.3 123.83,28.26 124.46,28.89 T13.2
SH_COL4
  Bottom 0.8: IC3.4 121.28,28.26 119.38,30.16 T14.2
SH_COL5
  Bottom 0.8: IC3.5 118.75,25.72 114.3,30.16 T15.2
SH_COL6
  Bottom 0.8: T16.2 109.22,29.84 111.44,27.62 113.98,27.62 116.2,25.4 IC3.6
SH_COL7
  Bottom 0.8: T17.2 104.14,29.84 107.63,26.35 111.76,26.35 113.67,24.45 IC3.7
VCC
  Bottom 0.8: IC4.3 71.12,8.57 72.07,9.53 72.07,10.16 C9.2 72.39,10.48 74.93,13.02 80.33,13.02 80.96,13.65 80.96,17.78 | 55.56,37.47 45.09,26.99 9.21,26.99 5.08,31.11 5.08,52.07 2.54,54.61 RESET5.2 | 55.56,37.47 55.56,72.39 58.42,75.25 59.05,75.25 LCD1.2 59.37,75.56 59.69,75.56 R2.P$2 | 80.96,17.78 80.96,22.86 76.83,26.99 66.36,26.99 55.88,37.47 55.56,37.47 | RESET3.1 16.51,46.99 10.16,46.99 RESET3.2 10.16,47.62 7.62,50.16 7.62,53.02 9.21,54.61 RESET5.1 9.21,54.93 13.34,59.05 | 13.34,59.05 16.51,62.23 RESET4.1 | 13.34,59.05 10.16,62.23 RESET4.2 9.84,62.55 9.84,63.18 7.62,65.41 7.62,67.94 20.64,80.96 61.28,80.96 | 13.34,59.05 17.46,54.93 RESET2.2 17.78,54.61 24.13,54.61 RESET2.1 | 61.28,80.96 JP2.1 | C3.2 81.28,50.16 IC1.20 75.88,50.16 73.98,50.16 73.5,50.64 | IC1.7 68.9,55.24 73.5,50.64 | 71.6,34.77 73.34,36.51 73.34,50.48 73.5,50.64 | 71.6,34.77 70.8,33.97 65.41,33.97 62.23,37.15 62.23,39.37 59.69,41.91 59.37,41.91 LCD1.15 | 182.25,14.61 186.37,14.61 | 186.37,14.61 193.04,14.61 R9.3 | IC2.16 182.25,14.61 | 165.1,12.7 IC2.10 | 165.1,12.7 169.54,8.26 176.21,8.26 182.25,14.29 182.25,14.61 | IC3.10 113.67,18.1 112.55,19.21 | 112.55,19.21 112.08,19.68 104.46,19.68 | 97.16,19.68 104.46,19.68 | 97.16,19.68 R1.P$2 97.16,19.68 | IC3.16 128.91,18.1 127.64,19.37 112.71,19.37 112.55,19.21 | 97.16,19.68 R4.P$2 85.09,32.07 84.77,32.07 82.23,29.53 76.83,29.53 71.75,34.61 71.6,34.77 | 165.1,12.7 164.78,12.7 156.84,12.7 151.13,6.99 116.84,6.99 104.46,19.37 104.46,19.68 | 193.36,21.91 193.36,73.98 180.02,87.31 66.36,87.31 61.28,82.23 61.28,81.28 61.28,80.96 | 193.36,21.91 186.37,14.92 186.37,14.61
  Bottom 0.8: 80.96,17.78 81.28,17.78 91.44,17.78 93.98,15.24 93.98,3.81 95.89,1.91 185.42,1.91 196.53,13.02 196.53,18.41 193.36,21.59 193.36,21.91
VCC1
  Bottom 0.8: RESET1.1 10.16,34.29 16.51,34.29 RESET1.2
VIN
  Bottom 0.8: 80.33,5.08 83.82,5.08 X1.2 | 80.33,5.08 IC4.1 | C7.1 80.33,5.4 80.33,5.08

### Text on the board
Bottom: Luis Henrique Fonseca Bueno / Marco Antonio Soares de Mello Alves